# Altium schematic sheet МПСУ.464414.22-01 MCU.SchDoc
size 420 x 297 mm; Address1: Address1; Address2: Address2; Address3: Address3; Address4: Address4; SheetNumber: 2; SheetTotal: 3; DocumentTypeSCH: Э3
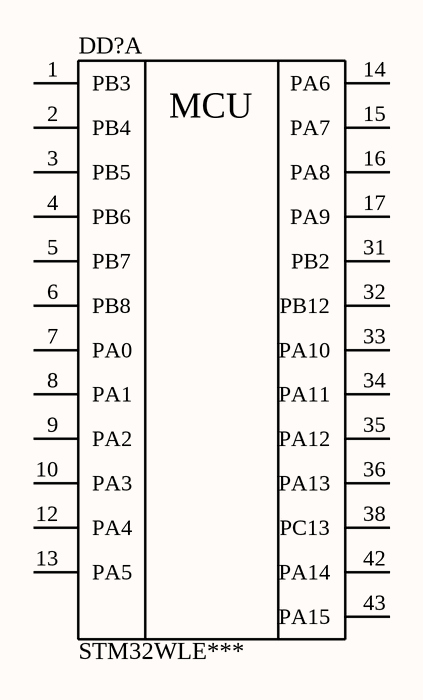
[diagram p0: МПСУ.464414.22-01 MCU.SchDoc]

## Parts
DD?  DD?  [QFN50P700X700X90_HS-49N]  (value not drawn)  (part A of 5)

## Nets

Not connected (* = marked no-connect by the designer): DD? 1(PB3) 2(PB4) 3(PB5) 4(PB6) 5(PB7) 6(PB8) 7(PA0) 8(PA1) 9(PA2) 10(PA3) 12(PA4) 13(PA5) 14(PA6) 15(PA7) 16(PA8) 17(PA9) 31(PB2) 32(PB12) 33(PA10) 34(PA11) 35(PA12) 36(PA13) 38(PC13) 42(PA14) 43(PA15)

## Notes on the sheet
- Подп. и дата
- Инв. № дубл.
- Взам. инв. №
- Инв. № подл.
- Изм.
- Лист
- № докум.
- Подп.
- Дата
- Копировал
- Формат А3

## Library data of the parts
DD? = STM32WLE***: Multiprotocol LPWAN 32-bit Arm® Cortex®-M4 MCUs, LoRa®, (G)FSK, (G)MSK, BPSK, up to 256KB Flash, 64KB SRAM; Manufacturer: ST Electronics; Designer: Лазба; 3D_Body: +; ComponentLink1Description: Техническое описание; ComponentLink1URL: Q:\Libs\Descriptions_PDF\DS13105.pdf; Category: IC; Subcategory: MCU; Status: Check; PartNumber: STM32WLE***